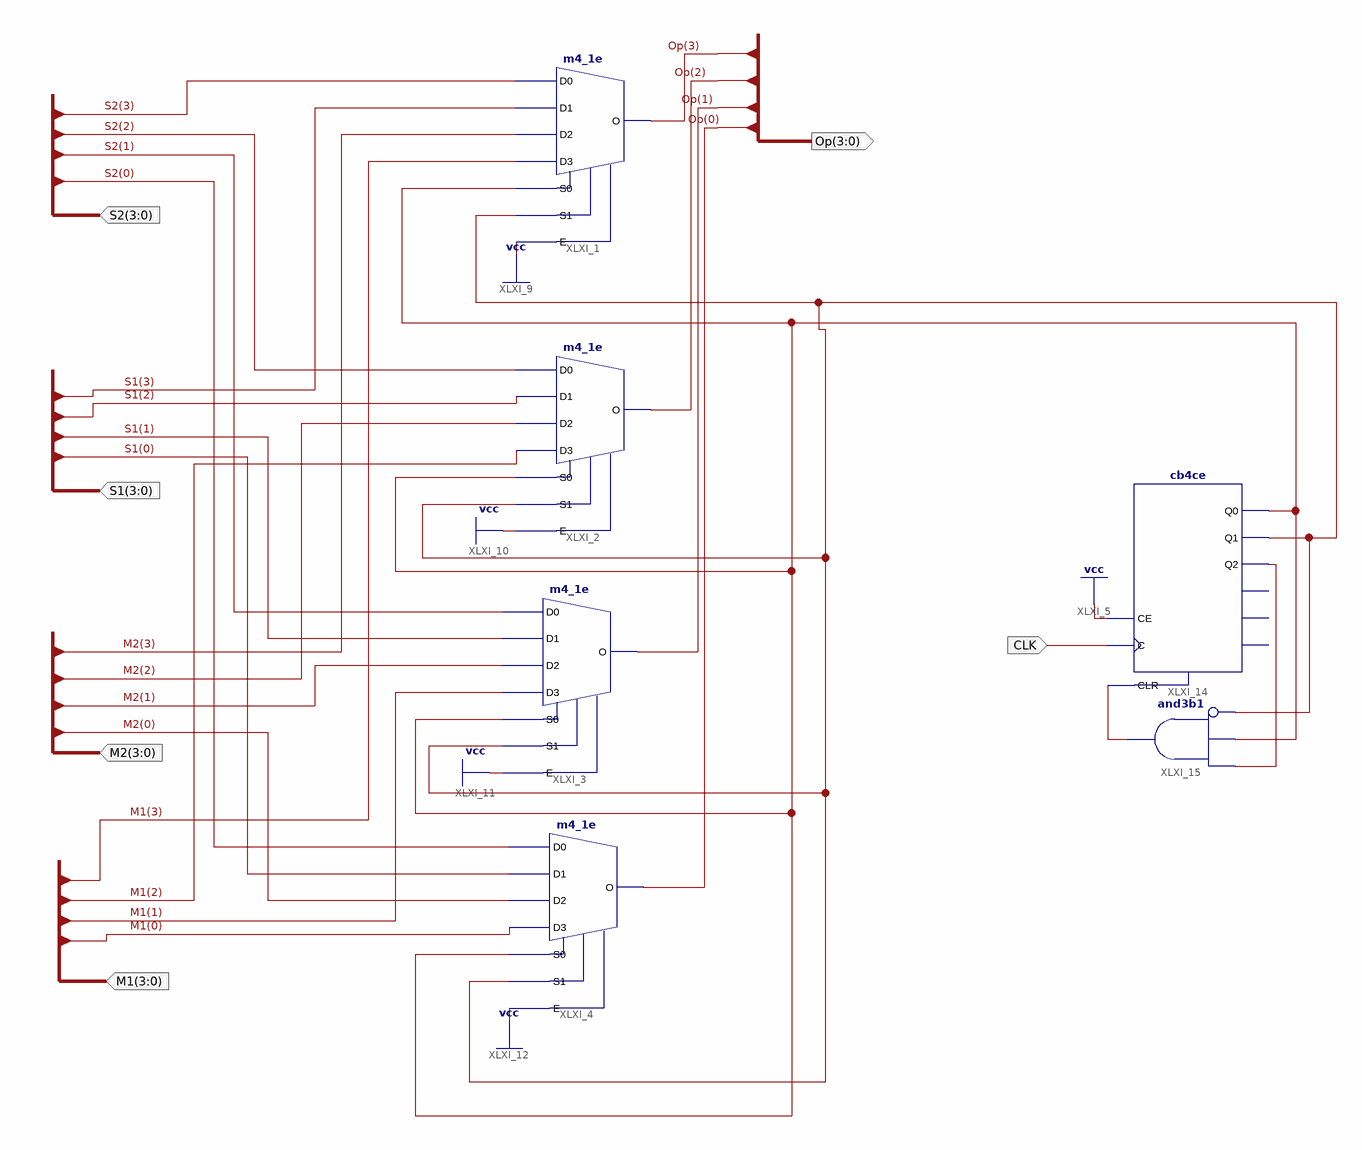
[diagram p0: schematic sheet 1]
// Xilinx ISE schematic MUX16_4.sch (spartan6) as structural Verilog: 6 symbols, 6 ports
module MUX16_4 (
  input  [3:0] S2,
  input  [3:0] S1,
  input  [3:0] M2,
  input  [3:0] M1,
  input  CLK,
  output [3:0] Op
);

  wire XLXN_59, XLXN_60, XLXN_67, XLXN_68;

  m4_1e XLXI_1 (.D0(S2[3]), .D1(S1[3]), .D2(M2[3]), .D3(M1[3]), .E(1'b1), .S0(XLXN_60), .S1(XLXN_59), .O(Op[3]));
  m4_1e XLXI_2 (.D0(S2[2]), .D1(S1[2]), .D2(M2[2]), .D3(M1[2]), .E(1'b1), .S0(XLXN_60), .S1(XLXN_59), .O(Op[2]));
  m4_1e XLXI_3 (.D0(S2[1]), .D1(S1[1]), .D2(M2[1]), .D3(M1[1]), .E(1'b1), .S0(XLXN_60), .S1(XLXN_59), .O(Op[1]));
  m4_1e XLXI_4 (.D0(S2[0]), .D1(S1[0]), .D2(M2[0]), .D3(M1[0]), .E(1'b1), .S0(XLXN_60), .S1(XLXN_59), .O(Op[0]));
  cb4ce XLXI_14 (.C(CLK), .CE(1'b1), .CLR(XLXN_67), .Q0(XLXN_60), .Q1(XLXN_59), .Q2(XLXN_68));  // open: CEO, Q3, TC
  and XLXI_15 (XLXN_67, ~XLXN_59, XLXN_60, XLXN_68);  // and3b1
endmodule
